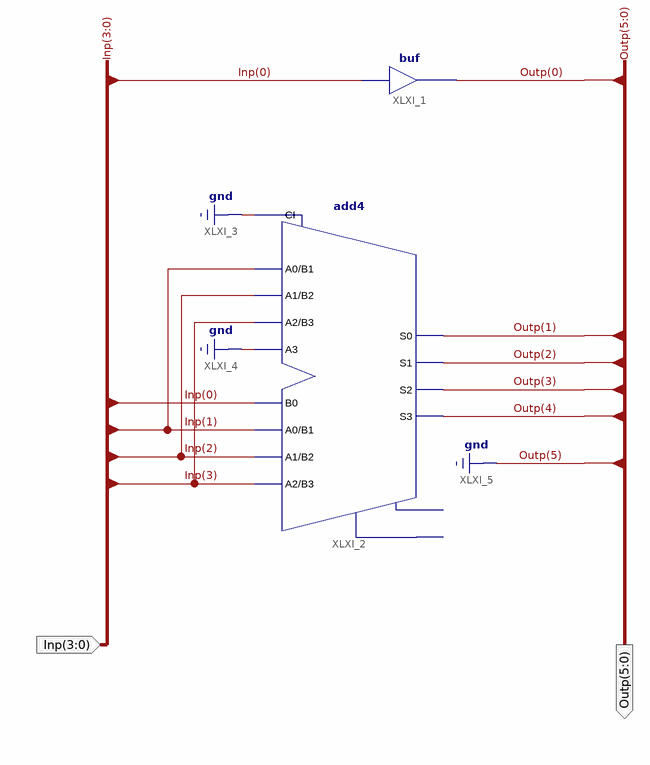
[diagram p0: schematic sheet 1]
// Xilinx ISE schematic Multiply_4Bit_3.sch (spartan3e) as structural Verilog: 2 symbols, 2 ports
module Multiply_4Bit_3 (
  input  [3:0] Inp,
  output [5:0] Outp
);

  buf XLXI_1 (Outp[0], Inp[0]);
  add4 XLXI_2 (
    .A0(Inp[1]), .A1(Inp[2]), .A2(Inp[3]), .A3(1'b0), .B0(Inp[0]), .B1(Inp[1]), .B2(Inp[2]), .B3(Inp[3]),
    .CI(1'b0), .S0(Outp[1]), .S1(Outp[2]), .S2(Outp[3]), .S3(Outp[4]));  // open: CO, OFL

  assign Outp[5] = 1'b0;
endmodule
